# EAGLE schematic Schematic Past (EAGLE 9.2.0)
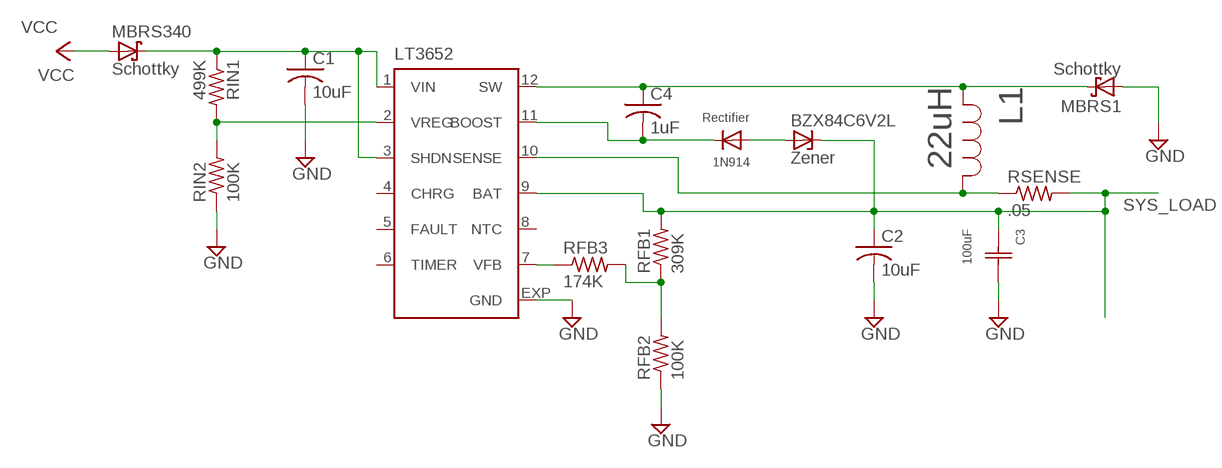
[diagram p0: schematic, sheet 1]

## Parts
1N914  Rectifier  DIODESOD-323F  [SOD-323F]
BZX84C6V2L  Zener  ZENER-DIODETO236  [TO236]
C1  10uF  C-USC0805  [C0805]
C2  10uF  C-USC0805  [C0805]
C3  100uF  EEETG1E101UP  [CAP_EEFK_E]
C4  1uF  C-USC0805  [C0805]
L1  22uH  SRR1205-220ML  [IND_BOURNS_SRR1205]
LT3652  LT3645MSE  [MSOP12]
MBRS1  Schottky  SCHOTTKY-DIODESMC  [SMC]
MBRS340  Schottky  SCHOTTKY-DIODESMC  [SMC]
RFB1  309K  R-US_R0603  [R0603]
RFB2  100K  R-US_R0603  [R0603]
RFB3  174K  R-US_R0603  [R0603]
RIN1  499K  R-US_R0603  [R0603]
RIN2  100K  R-US_R0603  [R0603]
RSENSE  .05  R-US_R2512  [R2512]

## Nets
GND: C1.2 C2.2 C3.2 LT3652.EXP(GND) MBRS1.A RFB2.1 RIN2.1
N$1: C4.1 L1.2 LT3652.12(SW) MBRS1.C
N$2: 1N914.C C4.2 LT3652.11(BOOST)
N$3: L1.1 LT3652.10(SENSE) RSENSE.1
N$4: 1N914.A BZX84C6V2L.A
N$7: RFB1.1 RFB2.2 RFB3.2
N$8: LT3652.7(VFB) RFB3.1
N$14: LT3652.2(VREG) RIN1.2 RIN2.2
N$16: C1.1 LT3652.1(VIN) LT3652.3(SHDN) MBRS340.C RIN1.1
SYS_LOAD: BZX84C6V2L.C C2.1 C3.1 LT3652.9(BAT) RFB1.2 RSENSE.2
VCC: MBRS340.A
Unconnected: LT3652.4(CHRG) LT3652.5(FAULT) LT3652.6(TIMER) LT3652.8(NTC)

## Library data of the parts
1N914 = adafruit:DIODE: Diode SMADIODE - SMA Surface Mount Package 20V 1A Schottky Diode Digikey: 641-1014-6-ND DO-1N4148 - Through Hole Small Current Diode SOD-123 20V 1 A (.5mV Vf) Schottky Diode - Digikey: MBRX120TPMSCT-ND SOD-323 10V 570mA (.38mV Vf, 3ns) Schottky Diode - Digikey: ZLLS410CT-ND SOD-523 30V 30mA Schottky Diode (RB751S-40TE61) - Digikey: RB751S-40TE61CT-ND SOT23-R/W - SOT23 Package (R = Solder Paste/Reflow Ovens, W = Hand-Soldering) BAT54Film 40V 300mA - Digikey: 497-7162-1-ND
BZX84C6V2L = diode:ZENER-DIODE: Z-Diode
C1 C2 C4 = adafruit:C-US: CAPACITOR, American symbol
C3 = PanasonicCap:EEETG1E101UP; MANUFACTURER_PART_NUMBER: EEETG1E101UP; VENDOR: Panasonic
L1 = 22uHBournes:SRR1205-220ML; MANUFACTURER_PART_NUMBER: SRR1205220ML; VENDOR: Bourns Electronics
LT3652 = LT3652:LT3645: 36V 500mA Step-Down Regulator and 200mA LDO Source: http://cds.linear.com/docs/en/datasheet/3645f.pdf
MBRS1 MBRS340 = diode:SCHOTTKY-DIODE: Schottky Diode
RFB1-RFB3 RIN1 RIN2 RSENSE = adafruit:R-US_: RESISTOR, American symbol